# Altium schematic sheet etna-sch-sensor.SchDoc
size A4; SheetNumber: 5; SheetTotal: 6; PageSetup: Record=PageOptions|CenterHorizontal=True|CenterVertical=True|PrintScale=0.73|XCorrection=1.00|YCorrection=1.00|PrintKind=1|BorderSize=5000000|LeftOffset=0|BottomOffset=0|Orientation=2|PaperLength=1000|PaperWidth=1000|Scale=100|PaperSource=15|PrintQuality=1200|MediaType=1|DitherType=10|PaperKind=A4|PrintScaleMode=1
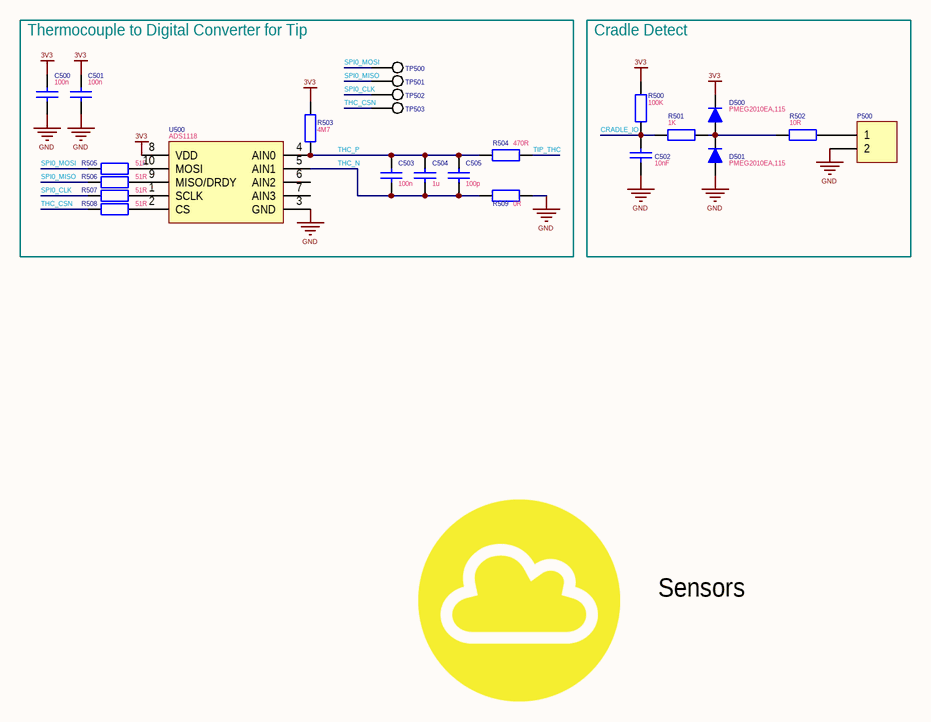
[diagram p0: etna-sch-sensor.SchDoc]

## Parts
C500  100n  [0402-capacitor]
C501  100n  [0402-capacitor]
C502  10nF  [0402-capacitor]
C503  100n  [0402-capacitor]
C504  1u  [0402-capacitor]
C505  100p  [0402-capacitor]
D500  PMEG2010EA,115  [SOD-323]
D501  PMEG2010EA,115  [SOD-323]
P500  (no value)  [HDR1X2]
R500  100K  [0402-resistor]
R501  1K  [0402-resistor]
R502  10R  [0402-resistor]
R503  4M7  [0402-resistor]
R504  470R  [0402-resistor]
R505  51R  [0402-resistor]
R506  51R  [0402-resistor]
R507  51R  [0402-resistor]
R508  51R  [0402-resistor]
R509  0R  [0402-resistor]
TP500  TP  [TESTPOINT]  (value not drawn)
TP501  TP  [TESTPOINT]  (value not drawn)
TP502  TP  [TESTPOINT]  (value not drawn)
TP503  TP  [TESTPOINT]  (value not drawn)
U500  ADS1118  [VSSOP-10]

## Blocks framed on the sheet
Thermocouple to Digital Converter for Tip: C500 C501 C503-C505 R503-R509 TP500-TP503 U500
Cradle Detect: C502 D500 D501 P500 R500-R502

## Nets
3V3: C500.2 C501.2 D500.2(K) R500.1 R503.1 U500.8(VDD)
GND: C500.1 C501.1 C502.1 D501.1(A) P500.2 R509.1 U500.3(GND)
CRADLE_IO: C502.2 R500.2 R501.1
SPI0_CLK: R507.2 TP502.1(GND)
SPI0_MISO: R506.2 TP501.1(GND)
SPI0_MOSI: R505.2 TP500.1(GND)
THC_CSN: R508.2 TP503.1(GND)
THC_N: C503.1 C504.1 C505.1 R509.2 U500.5(AIN1)
THC_P: C503.2 C504.2 C505.2 R503.2 R504.2 U500.4(AIN0)
TIP_THC: R504.1
NetD500_1: D500.1(A) D501.2(K) R501.2 R502.1
NetP500_1: P500.1 R502.2
NetR505_1: R505.1 U500.10(MOSI)
NetR506_1: R506.1 U500.9(MISO/DRDY)
NetR507_1: R507.1 U500.1(SCLK)
NetR508_1: R508.1 U500.2(CS)

Not connected (* = marked no-connect by the designer): U500 6(AIN2) 7(AIN3)

## Notes on the sheet
- Sensors

## Library data of the parts
C500-C505 = CAP: Capacitor
D500 D501 = DIODE: Published: 8-Jun-2000; LatestRevisionDate: 17-Jul-2002; LatestRevisionNote: Re-released for DXP Platform.; PackageVersion: Sep-1996; PackageReference: SMC; Publisher: Altium Limited; PackageDescription: DO-214-AB/SMC; 2 C-Bend Leads; Body 7.9 x 5.9 mm, inc. leads (LxW); Code_JEDEC: DO-214-AB
P500 = Header 2: Header, 2-Pin; LatestRevisionDate: 17-Jul-2002; LatestRevisionNote: Re-released for DXP Platform.; Publisher: Altium Limited
R500-R509 = RES: Resistor
TP500-TP503 = TEST_POINT
U500 = ADS1118: ADS1118 Ultrasmall, Low-Power, SPI™-Compatible, 16-Bit  Analog-to-Digital Converter with Internal Reference and Temperature Sensor